# EAGLE design rev1 (EAGLE 7.3.0)
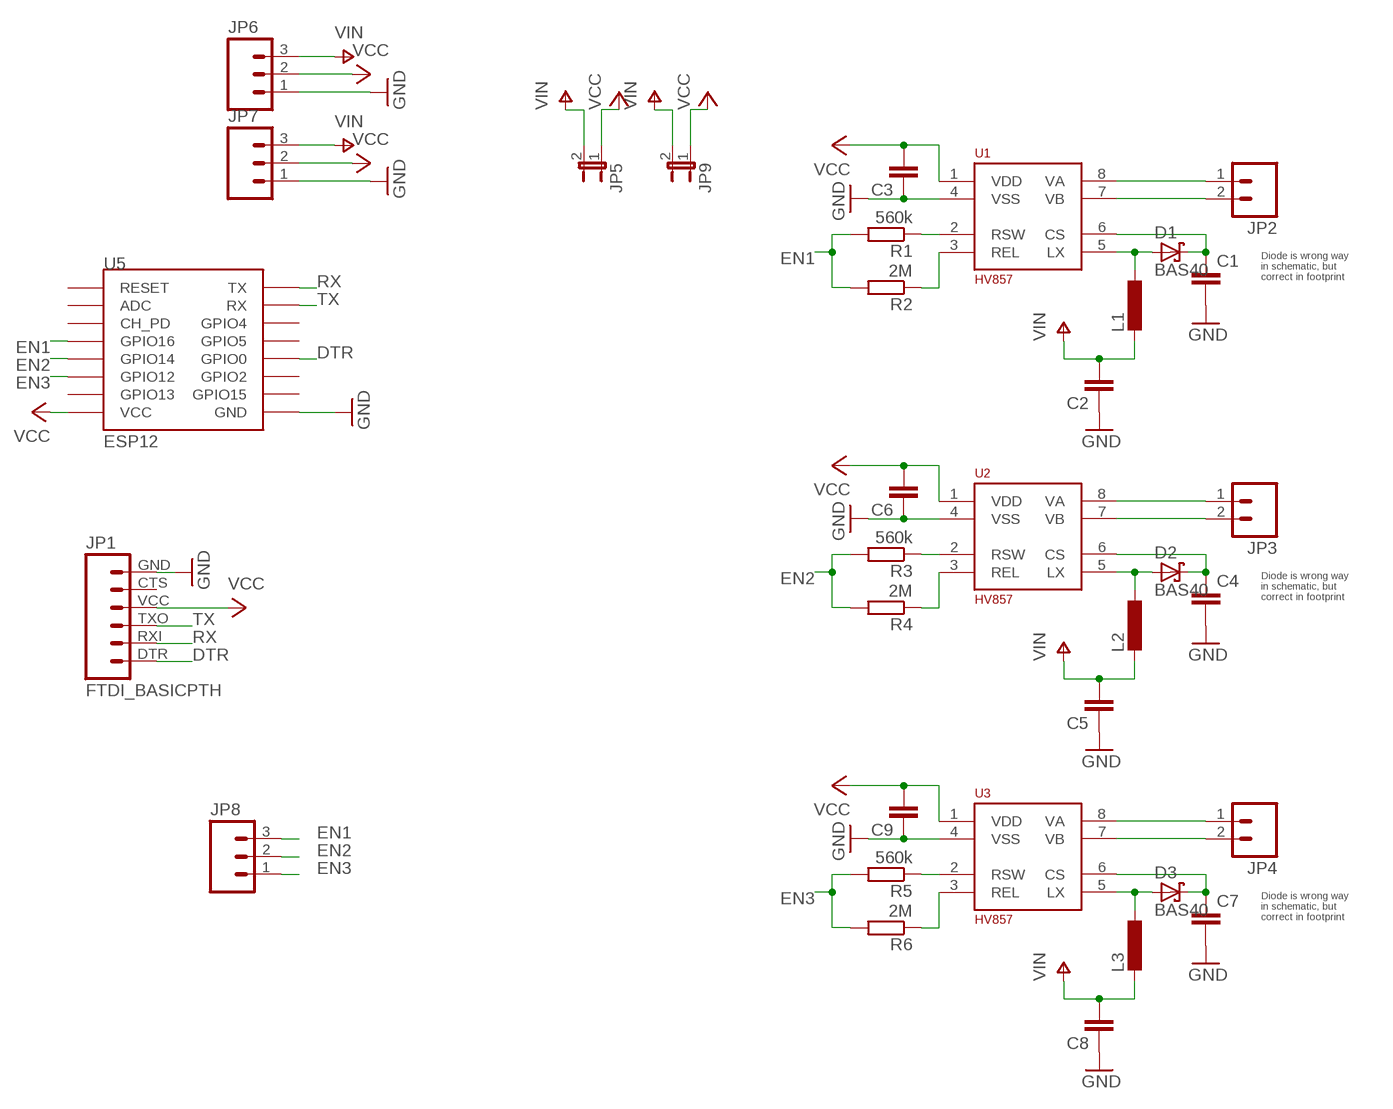
[diagram p0: schematic, sheet 1]

## Parts
C1  C-EUC0603  [C0603]
C2  C-EUC0603  [C0603]
C3  C-EUC0603  [C0603]
C4  C-EUC0603  [C0603]
C5  C-EUC0603  [C0603]
C6  C-EUC0603  [C0603]
C7  C-EUC0603  [C0603]
C8  C-EUC0603  [C0603]
C9  C-EUC0603  [C0603]
D1  BAS40  [SOT23]
D2  BAS40  [SOT23]
D3  BAS40  [SOT23]
JP1  FTDI_BASICPTH  [FTDI_BASIC]
JP2  M02PTH  [1X02]
JP3  M02PTH  [1X02]
JP4  M02PTH  [1X02]
JP5  JUMPER-2SMD-NC  [SJ_2S]
JP6  M03PTH  [1X03]
JP7  M03PTH  [1X03]
JP8  M03PTH  [1X03]
JP9  JUMPER-2SMD-NC  [SJ_2S]
L1  L-EUL3225M  [L3225M]
L2  L-EUL3225M  [L3225M]
L3  L-EUL3225M  [L3225M]
R1  560k  R-EU_R0603  [R0603]
R2  2M  R-EU_R0603  [R0603]
R3  560k  R-EU_R0603  [R0603]
R4  2M  R-EU_R0603  [R0603]
R5  560k  R-EU_R0603  [R0603]
R6  2M  R-EU_R0603  [R0603]
U1  HV857  [MSOP8]
U2  HV857  [MSOP8]
U3  HV857  [MSOP8]
U5  ESP12  [ESP12]

## Nets
DTR: JP1.DTR U5.GPIO0
EN1: JP8.3 R1.2 R2.2 U5.GPIO16
EN2: JP8.2 R3.2 R4.2 U5.GPIO14
EN3: JP8.1 R5.2 R6.2 U5.GPIO12
GND: C1.2 C2.1 C3.1 C4.2 C5.1 C6.1 C7.2 C8.1 C9.1 JP1.GND JP6.1 JP7.1 U1.4(VSS) U2.4(VSS) U3.4(VSS) U5.GND
N$1: R1.1 U1.2(RSW)
N$2: R2.1 U1.3(REL)
N$4: R3.1 U2.2(RSW)
N$5: JP2.1 U1.8(VA)
N$6: JP2.2 U1.7(VB)
N$7: C1.1 D1.3(C) U1.6(CS)
N$9: D1.1(A) L1.1 U1.5(LX)
N$10: R4.1 U2.3(REL)
N$11: D2.1(A) L2.1 U2.5(LX)
N$12: C4.1 D2.3(C) U2.6(CS)
N$13: JP3.1 U2.8(VA)
N$14: JP3.2 U2.7(VB)
N$15: R5.1 U3.2(RSW)
N$16: R6.1 U3.3(REL)
N$17: D3.1(A) L3.1 U3.5(LX)
N$18: C7.1 D3.3(C) U3.6(CS)
N$19: JP4.1 U3.8(VA)
N$20: JP4.2 U3.7(VB)
RX: JP1.RXI U5.TX
TX: JP1.TXO U5.RX
V+: C2.2 C5.2 C8.2 JP5.2 JP6.3 JP7.3 JP9.2 L1.2 L2.2 L3.2 ; supply symbol labelled VIN
VCC: C3.2 C6.2 C9.2 JP1.VCC JP5.1 JP6.2 JP7.2 JP9.1 U1.1(VDD) U2.1(VDD) U3.1(VDD) U5.VCC
Unconnected: JP1.CTS U5.ADC U5.CH_PD U5.GPIO2 U5.GPIO4 U5.GPIO5 U5.GPIO13 U5.GPIO15 U5.RESET

## Notes on the sheet
- Diode is wrong way
  in schematic, but
  correct in footprint
- Diode is wrong way
  in schematic, but
  correct in footprint
- Diode is wrong way
  in schematic, but
  correct in footprint

## Library data of the parts
C1-C9 = rcl:C-EU: CAPACITOR, European symbol
D1-D3 = diode:BAS40: Silicon Schottky Diodes General-purpose diode for high-speed switching
JP1 = SparkFun:FTDI_BASIC: FTDI Basic: 3.3V and 5V
JP2-JP4 = SparkFun:M02: Header 2 Standard 2-pin 0.1" header. Use with straight break away headers (SKU : PRT-00116), right angle break away headers (PRT-00553), swiss pins (PRT-00743), machine pins (PRT-00117), and female headers (PRT-00115). Molex polarized connector foot print use with SKU : PRT-08233 with associated crimp pins and housings.
JP5 JP9 = SparkFun:JUMPER-2: Jumper Basic 0.1" spaced jumper. Use with breakaway headers.
JP6-JP8 = SparkFun:M03: Header 3 Standard 3-pin 0.1" header. Use with straight break away headers (SKU : PRT-00116), right angle break away headers (PRT-00553), swiss pins (PRT-00743), machine pins (PRT-00117), and female headers (PRT-00115). Molex polarized connector foot print use with SKU : PRT-08232 with associated crimp pins and housings.
L1-L3 = rcl:L-EU: INDUCTOR, European symbol
R1-R6 = rcl:R-EU_: RESISTOR, European symbol
U1-U3 = HV857:HV857
U5 = esp8266modules:ESP12: ESP8266 Wifi module 12

## Board
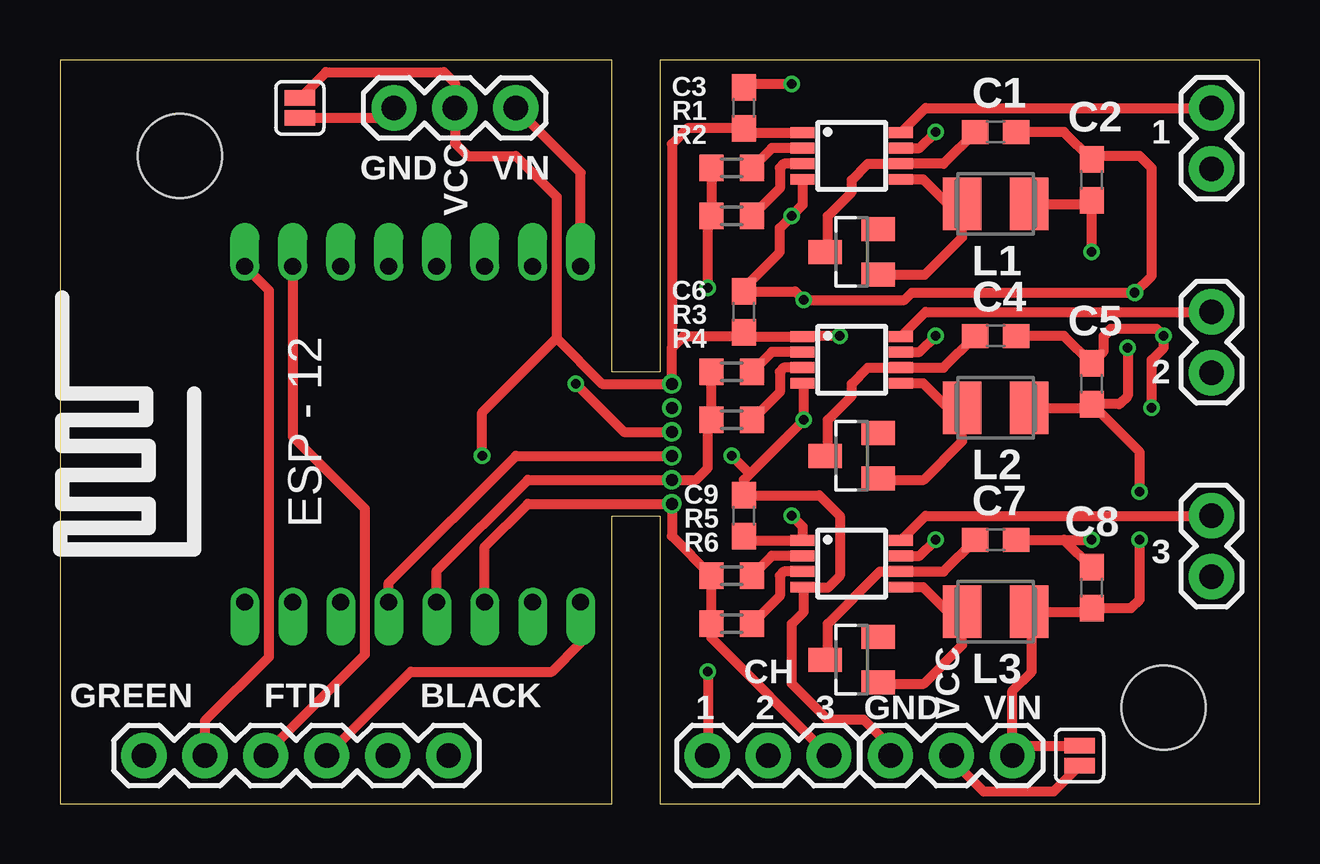
[diagram p1: board, top side]
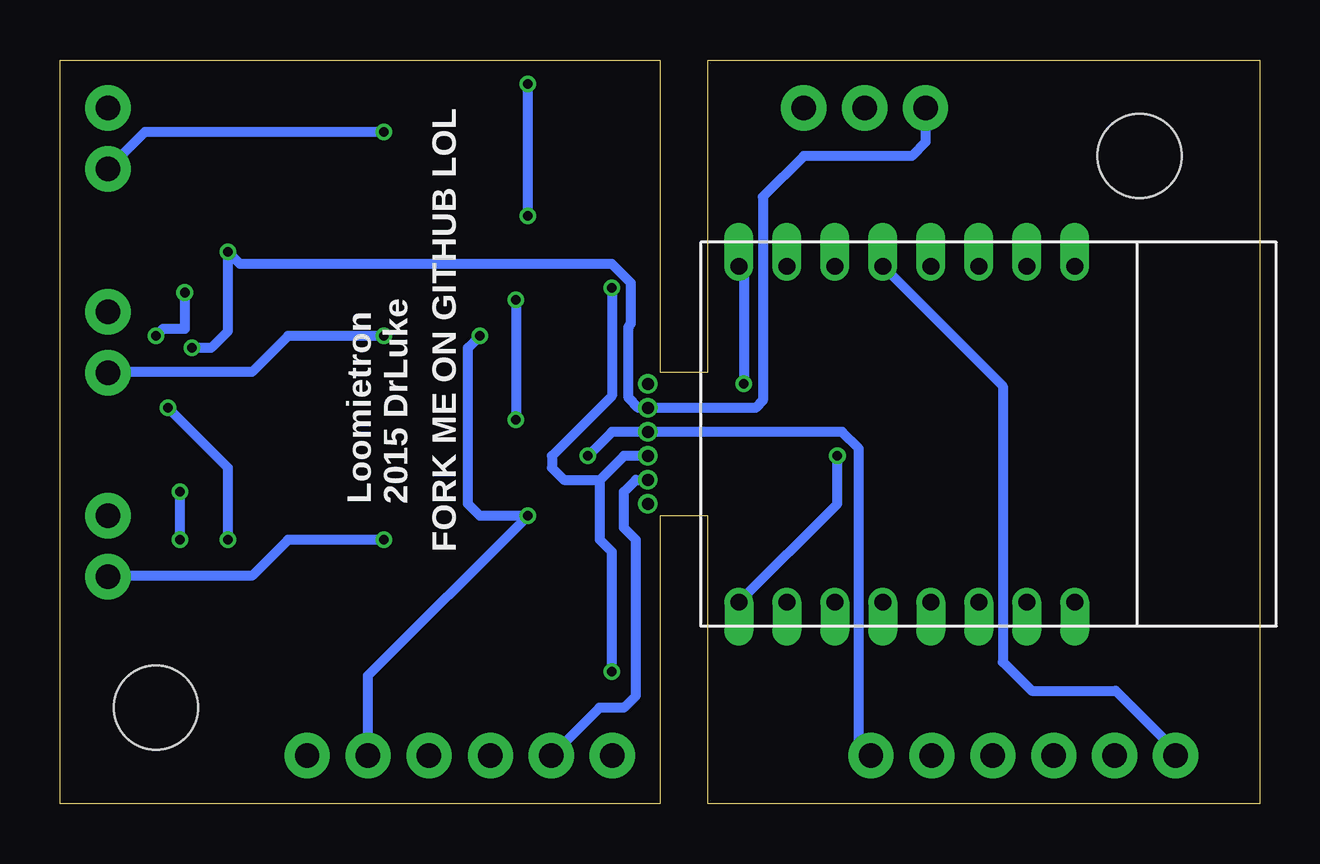
[diagram p2: board, bottom side, seen from below]

Size 50 x 31 mm. Coordinates in mm from the lower left corner, seen from the top.
Outline: 0,0 23,0 23,12 25,12 25,0 50,0 50,31 25,31 25,18 23,18 23,31 0,31 0,0
Copper layers (1*16): Top 0.035mm / dielectric 1.5mm / Bottom 0.035mm
Design rules "hackvana": minimum track width 6mil, minimum drill 0.3mm, track to track 6mil, track to pad 6mil, pad to pad 6mil, via to via 6mil, smd to smd 0mil, copper to edge 6mil, drill to drill 6mil, minimum pad ring 10mil, minimum via ring 6mil, stop-mask expansion 2mil, vias tented up to drill 100mil, thermal gap 10mil
Holes 3.5 mm at 5,27 46,4

### Footprints (pad centres in the part's own frame; a part is rotated, then mirrored left to right if it is on the bottom)
C0603 = smd 1.1 x 1: 1 -0.85,0; 2 0.85,0
SOT23 = smd 1 x 1.4: 1 -0.95,-1.1; 2 0.95,-1.1; 3 0,1.1
FTDI_BASIC = drill 1.016 pad 1.88: CTS 10.16,0; DTR 0,0; GND 12.7,0; RXI 2.54,0; TXO 5.08,0; VCC 7.62,0
1X02 = drill 1.016 pad 1.88: 1 0,0; 2 2.54,0
SJ_2S = smd 0.635 x 1.27: 1 -0.412,0; 2 0.412,0
1X03 = drill 1.016 pad 1.88: 1 0,0; 2 2.54,0; 3 5.08,0
L3225M = smd 1.6 x 2.2: 1 -1.4,0; 2 1.4,0
R0603 = smd 1 x 1.1: 1 -0.85,0; 2 0.85,0
MSOP8 = smd 0.45 x 1: 1 -0.975,-2.05; 2 -0.325,-2.05; 3 0.325,-2.05; 4 0.975,-2.05; 5 0.975,2.05; 6 0.325,2.05; 7 -0.325,2.05; 8 -0.975,2.05
ESP12 = drill 0.7 offset: ADC -7.1,3.8; CH_PD -7.1,1.8; GND 6.9,-8.2; GPIO0 6.9,-2.2; GPIO2 6.9,-4.2; GPIO4 6.9,1.8; GPIO5 6.9,-0.2; GPIO12 -7.1,-4.2; GPIO13 -7.1,-6.2; GPIO14 -7.1,-2.2; GPIO15 6.9,-6.2; GPIO16 -7.1,-0.2; RESET -7.1,5.8; RX 6.9,3.8; TX 6.9,5.8; VCC -7.1,-8.2

### Placement (x,y rotation side)
C1  39,28 0 top
C2  43,26 270 top
C3  28.5,29 270 top
C4  39,19.5 0 top
C5  43,17.5 270 top
C6  28.5,20.5 270 top
C7  39,11 0 top
C8  43,9 270 top
C9  28.5,12 270 top
D1  33,23 90 top
D2  33,14.5 90 top
D3  33,6 90 top
JP1  3.5,2 0 top
JP2  48,29 270 top
JP3  48,20.5 270 top
JP4  48,12 270 top
JP5  10,29 270 top
JP6  19,29 180 top
JP7  34.62,2 0 top
JP8  32.06,2 180 top
JP9  42.5,2 90 top
L1  39,25 0 top
L2  39,16.5 0 top
L3  39,8 0 top
R1  28,26.5 180 top
R2  28,24.5 180 top
R3  28,18 180 top
R4  28,16 180 top
R5  28,9.5 180 top
R6  28,7.5 180 top
U1  33,27 270 top
U2  33,18.5 270 top
U3  33,10 270 top
U5  13.5,15.5 90 top

### Tracks (layer width: path | path; a pad name or v marks a point on that pad's centre or on a via)
DTR
  Bottom 0.406: U5.GPIO0 10.7,17.4 10.7,5.9 9.5,4.7 6,4.7 3.5,2.2 JP1.DTR
EN1  (via drill 0.4, 0.5)
  Top 0.406: R1.2 R2.2 27,24.35 v27,21.5 | U5.GPIO16 13.7,9.2 19,14.5 v25.5,14.5 | v27,5.5 27,2.02 JP8.3
  Bottom 0.406: v25.5,14.5 26.5,14.5 27.5,13.5 | v27,5.5 27,10.5 27.5,11 27.5,13.5 | v27,21.5 27,17 29.5,14.5 29.5,14 29,13.5 27.5,13.5
EN2  (via drill 0.5)
  Top 0.406: U5.GPIO14 15.7,9.7 19.5,13.5 v25.5,13.5 26.5,13.5 27,14 27,15.85 R4.2 R3.2
  Bottom 0.406: v25.5,13.5 26,13.5 26.5,13 26.5,11.5 26,11 26,4.5 26.5,4 27.52,4 JP8.2
EN3  (via drill 0.5)
  Top 0.406: U5.GPIO12 17.7,10.7 19.5,12.5 v25.5,12.5 25.5,11.15 R5.2 R6.2 | 27,7.35 R6.2 | R6.2 27.15,6.91 JP8.1
GND  (via drill 0.4, 0.5)
  Top 0.406: C1.2 41.85,28 C2.1 43.15,27 45,27 45.5,26.5 45.5,22 v44.8,21.3 35.5,21.3 35.2,21 v31,21 30.65,21.35 C6.1 28.5,21.5 30,23 30,24 v30.5,24.5 30.95,24.95 U1.4 | C4.2 41.85,19.5 C5.1 43.5,18.85 43.5,19.5 43.8,19.8 45.7,19.8 v46,19.5 46,19 45.5,18.5 v45.5,16.5 | C7.2 41.85,11 | 41.85,11 C8.1 | v21.5,17.5 23.5,15.5 v25.5,15.5 | U5.GND 21.7,26.3 JP6.1 | v30.5,30 28.65,30 C3.1 | U2.4 31,17.48 v31,16 28.75,13.75 | 28.75,13.75 28.5,13.5 C9.1 31.65,12.85 32.5,12 32.5,9.5 32,9 30.98,9 U3.4 31,8.97 31,8 30.5,7.5 30.5,5 32,3.5 33.5,3.5 34.62,2.38 JP7.1 | v28,14.5 28.75,13.75 | 41.85,11 v43,11
  Bottom 0.406: U5.GND 21.5,22.2 v21.5,17.5 | JP1.GND 16.7,2.5 16.7,14.8 17.4,15.5 v25.5,15.5 27,15.5 v28,14.5 | v30.5,24.5 v30.5,30 | v31,21 v31,16 | v44.8,21.3 44.8,19.8 45.7,19.8 v46,19.5 | v43,11 43,14 v45.5,16.5
N$1
  Top 0.406: U1.2 29.68,27.32 R1.1
N$2
  Top 0.406: U1.3 30.18,26.68 30,26.5 30,25.65 R2.1
N$4
  Top 0.406: U2.2 29.68,18.82 R3.1
N$5
  Top 0.406: U1.8 36.08,29 JP2.1
N$6  (via drill 0.4)
  Top 0.406: U1.7 35.83,27.32 v36.5,28
  Bottom 0.406: v36.5,28 46.46,28 JP2.2
N$7
  Top 0.406: C1.1 36.83,26.68 U1.6 33.67,26.68 33,26 33,25.5 32,24.5 32,23.1 D1.3
N$9
  Top 0.406: U1.5 35.98,26.02 37,25 L1.1 37.6,23.6 36.05,22.05 D1.1
N$10
  Top 0.406: U2.3 30.18,18.18 30,18 30,17.15 R4.1
N$11
  Top 0.406: U2.5 35.98,17.52 37,16.5 L2.1 37.6,15.1 36,13.5 34.15,13.5 D2.1
N$12
  Top 0.406: C4.1 36.83,18.18 U2.6 33.67,18.18 33,17.5 33,17 32,16 32,14.6 D2.3
N$13
  Top 0.406: U2.8 36.08,20.5 JP3.1
N$14  (via drill 0.4)
  Top 0.406: U2.7 35.83,18.82 v36.5,19.5
  Bottom 0.406: v36.5,19.5 40.5,19.5 42,18 47.96,18 JP3.2
N$15
  Top 0.406: U3.2 29.68,10.32 R5.1
N$16
  Top 0.406: U3.3 30.18,9.68 30,9.5 30,8.65 R6.1
N$17
  Top 0.406: D3.1 34.15,5 36,5 37.6,6.6 L3.1 37,8 35.98,9.03 U3.5
N$18
  Top 0.406: D3.3 32,6.1 32,7.5 34.17,9.68 U3.6 36.83,9.68 C7.1
N$19
  Top 0.406: U3.8 36.08,12 JP4.1
N$20  (via drill 0.4)
  Top 0.406: U3.7 35.83,10.32 v36.5,11
  Bottom 0.406: v36.5,11 40.5,11 42,9.5 47.96,9.5 JP4.2
RX
  Top 0.406: U5.TX 8.7,21.4 8.7,6.1 6.04,3.44 JP1.RXI
TX
  Top 0.406: U5.RX 9.7,15.3 12.7,12.3 12.7,6.2 8.58,2.08 JP1.TXO
V+  (via drill 0.4, 0.5)
  Top 0.406: JP5.2 13.51,28.59 JP6.3 | L1.2 42.85,25 C2.2 v43,23 | v45,11 45,8.5 44.65,8.15 C8.2 42.85,8 L3.2 40.5,7.9 40.5,5.5 39.7,4.7 JP7.3 40.11,2.41 JP9.2 | v45,13 45,14.65 C5.2 | L2.2 42.85,16.5 C5.2 | v44.5,19 44.5,17 44.15,16.65 C5.2
  Bottom 0.406: JP6.3 13.92,27.58 14.5,27 19,27 20.7,25.3 20.7,16.8 21,16.5 v25.5,16.5 25.9,16.5 26.3,16.9 26.3,19.9 26.2,20 26.2,21.7 27,22.5 42.5,22.5 v43,23 43,19.7 43.7,19 v44.5,19 | v45,11 v45,13
VCC  (via drill 0.4, 0.5)
  Top 0.406: U1.1 28.68,27.98 C3.2 26.15,28.15 25.5,27.5 25.5,19 | C9.2 28.68,10.97 U3.1 30.95,11.55 v30.5,12 | 20.7,19.4 20.7,25.3 19,27 17,27 16.46,27.54 JP6.2 16.46,30.04 16,30.5 11.09,30.5 JP5.1 | 20.7,19.4 22.6,17.5 v25.5,17.5 25.5,19 | JP1.VCC 14.62,5.5 20.5,5.5 21.7,6.7 U5.VCC | v17.6,14.5 17.6,16.3 20.7,19.4 | 25.5,19 26,19.5 28.35,19.5 C6.2 28.68,19.48 U2.1 30.98,19.5 v32.5,19.5 | JP9.1 41.41,0.5 38.5,0.5 37.16,1.84 JP7.2
  Bottom 0.406: U5.VCC 17.6,12.5 v17.6,14.5 | JP7.2 37.16,5.34 v30.5,12 32.5,12 33,12.5 33,19 v32.5,19.5

### Text on the board
tPlace: 1 | GND | VIN | VCC | 2 | 3 | CH | GREEN | FTDI | BLACK | 1 | 2 | 3 | GND | VCC | VIN
bPlace: FORK ME ON GITHUB LOL | Loomietron / 2015 DrLuke